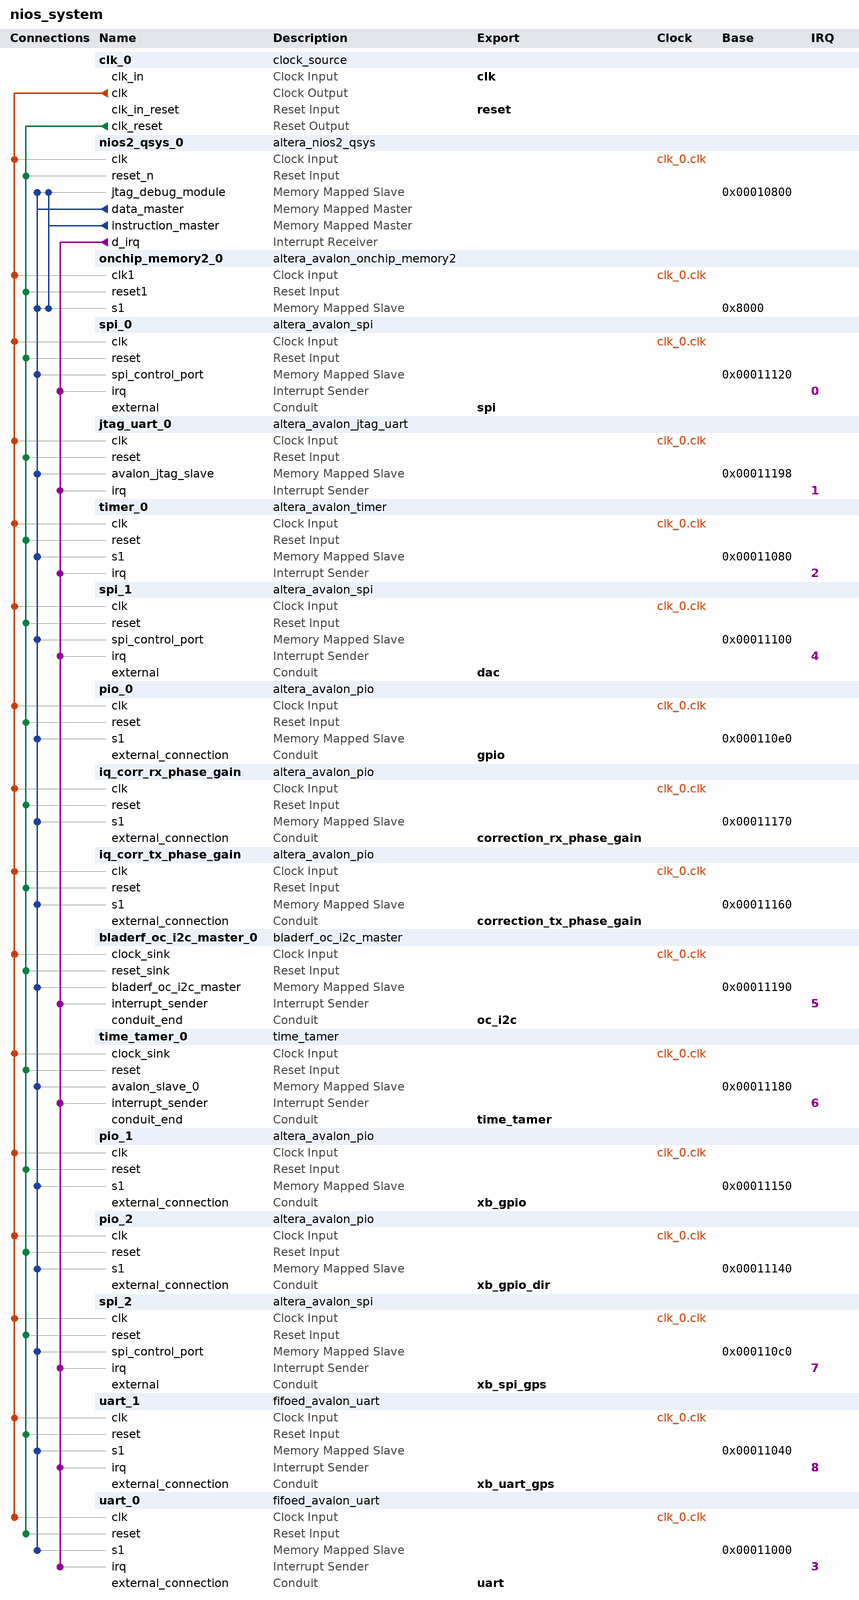
[diagram p0: system contents]
# Platform Designer (Qsys) system nios_system, Cyclone IV E EP4CE40F23C8
# Parameters at their usual value, and those the tool derives, are not listed.
package require -exact qsys 13.1
create_system nios_system
set_project_property DEVICE_FAMILY {Cyclone IV E}
set_project_property DEVICE EP4CE40F23C8

add_instance clk_0 clock_source 13.1
set_instance_parameter_value clk_0 clockFrequency 80000000
set_instance_parameter_value clk_0 resetSynchronousEdges DEASSERT

add_instance nios2_qsys_0 altera_nios2_qsys 13.1
set_instance_parameter_value nios2_qsys_0 resetSlave onchip_memory2_0.s1
set_instance_parameter_value nios2_qsys_0 exceptionSlave onchip_memory2_0.s1
set_instance_parameter_value nios2_qsys_0 breakSlave nios2_qsys_0.jtag_debug_module
set_instance_parameter_value nios2_qsys_0 impl Tiny
set_instance_parameter_value nios2_qsys_0 icache_size 2048

add_instance onchip_memory2_0 altera_avalon_onchip_memory2 13.1
set_instance_parameter_value onchip_memory2_0 dataWidth 32
set_instance_parameter_value onchip_memory2_0 dualPort false
set_instance_parameter_value onchip_memory2_0 initMemContent true
set_instance_parameter_value onchip_memory2_0 initializationFileName onchip_mem.hex
set_instance_parameter_value onchip_memory2_0 memorySize 32768

add_instance spi_0 altera_avalon_spi 13.1
set_instance_parameter_value spi_0 clockPolarity 0
set_instance_parameter_value spi_0 dataWidth 8
set_instance_parameter_value spi_0 masterSPI true
set_instance_parameter_value spi_0 numberOfSlaves 1
set_instance_parameter_value spi_0 targetClockRate 40000000
set_instance_parameter_value spi_0 targetSlaveSelectToSClkDelay 2.0

add_instance jtag_uart_0 altera_avalon_jtag_uart 13.1
set_instance_parameter_value jtag_uart_0 simInteractiveOptions INTERACTIVE_INPUT_OUTPUT

add_instance timer_0 altera_avalon_timer 13.1
set_instance_parameter_value timer_0 counterSize 64
set_instance_parameter_value timer_0 period 1
set_instance_parameter_value timer_0 periodUnits MSEC

add_instance spi_1 altera_avalon_spi 13.1
set_instance_parameter_value spi_1 clockPhase 1
set_instance_parameter_value spi_1 clockPolarity 1
set_instance_parameter_value spi_1 dataWidth 8
set_instance_parameter_value spi_1 masterSPI true
set_instance_parameter_value spi_1 numberOfSlaves 2
set_instance_parameter_value spi_1 targetClockRate 9600000

add_instance pio_0 altera_avalon_pio 13.1
set_instance_parameter_value pio_0 bitModifyingOutReg true
set_instance_parameter_value pio_0 direction Output
set_instance_parameter_value pio_0 width 32

add_instance iq_corr_rx_phase_gain altera_avalon_pio 13.1
set_instance_parameter_value iq_corr_rx_phase_gain direction Output
set_instance_parameter_value iq_corr_rx_phase_gain width 32

add_instance iq_corr_tx_phase_gain altera_avalon_pio 13.1
set_instance_parameter_value iq_corr_tx_phase_gain direction Output
set_instance_parameter_value iq_corr_tx_phase_gain resetValue 1
set_instance_parameter_value iq_corr_tx_phase_gain width 32

add_instance bladerf_oc_i2c_master_0 bladerf_oc_i2c_master 1.0
set_instance_parameter_value bladerf_oc_i2c_master_0 ARST_LVL 1

add_instance time_tamer_0 time_tamer 1.0
set_instance_parameter_value time_tamer_0 RESET_LEVEL 1

add_instance pio_1 altera_avalon_pio 13.1
set_instance_parameter_value pio_1 direction InOut
set_instance_parameter_value pio_1 width 32

add_instance pio_2 altera_avalon_pio 13.1
set_instance_parameter_value pio_2 direction Output
set_instance_parameter_value pio_2 width 32

add_instance spi_2 altera_avalon_spi 13.1
set_instance_parameter_value spi_2 clockPhase 1
set_instance_parameter_value spi_2 clockPolarity 0
set_instance_parameter_value spi_2 dataWidth 8
set_instance_parameter_value spi_2 masterSPI true
set_instance_parameter_value spi_2 numberOfSlaves 1
set_instance_parameter_value spi_2 targetClockRate 6700000

add_instance uart_1 fifoed_avalon_uart 13.1
set_instance_parameter_value uart_1 baud 4800
set_instance_parameter_value uart_1 dataBits 8
set_instance_parameter_value uart_1 fixedBaud false
set_instance_parameter_value uart_1 parity NONE
set_instance_parameter_value uart_1 simInteractiveInputEnable false
set_instance_parameter_value uart_1 simInteractiveOutputEnable false
set_instance_parameter_value uart_1 simTrueBaud false
set_instance_parameter_value uart_1 stopBits 1
set_instance_parameter_value uart_1 syncRegDepth 2
set_instance_parameter_value uart_1 useCtsRts false
set_instance_parameter_value uart_1 useEopRegister false
set_instance_parameter_value uart_1 useRelativePathForSimFile false
set_instance_parameter_value uart_1 use_status_bit_clear false
set_instance_parameter_value uart_1 use_tx_fifo true
set_instance_parameter_value uart_1 fifo_size_tx 256
set_instance_parameter_value uart_1 tx_fifo_LE false
set_instance_parameter_value uart_1 tx_IRQ_Threshold 1
set_instance_parameter_value uart_1 use_rx_fifo true
set_instance_parameter_value uart_1 fifo_size_rx 8192
set_instance_parameter_value uart_1 rx_fifo_LE false
set_instance_parameter_value uart_1 rx_IRQ_Threshold 1
set_instance_parameter_value uart_1 fifo_export_used false
set_instance_parameter_value uart_1 hw_cts false
set_instance_parameter_value uart_1 trans_pin false
set_instance_parameter_value uart_1 use_timout true
set_instance_parameter_value uart_1 timeout_value 4
set_instance_parameter_value uart_1 use_gap_detection false
set_instance_parameter_value uart_1 gap_value 4
set_instance_parameter_value uart_1 use_timestamp false
set_instance_parameter_value uart_1 use_ext_timestamp false
set_instance_parameter_value uart_1 timestamp_width 8
set_instance_parameter_value uart_1 export_handshake false
set_instance_parameter_value uart_1 add_error_bits false
set_instance_parameter_value uart_1 driver_pass_error_bits false

add_instance uart_0 fifoed_avalon_uart 13.1
set_instance_parameter_value uart_0 baud 115200
set_instance_parameter_value uart_0 dataBits 8
set_instance_parameter_value uart_0 fixedBaud false
set_instance_parameter_value uart_0 parity NONE
set_instance_parameter_value uart_0 simInteractiveInputEnable false
set_instance_parameter_value uart_0 simInteractiveOutputEnable false
set_instance_parameter_value uart_0 simTrueBaud false
set_instance_parameter_value uart_0 stopBits 1
set_instance_parameter_value uart_0 syncRegDepth 2
set_instance_parameter_value uart_0 useCtsRts false
set_instance_parameter_value uart_0 useEopRegister false
set_instance_parameter_value uart_0 useRelativePathForSimFile false
set_instance_parameter_value uart_0 use_status_bit_clear false
set_instance_parameter_value uart_0 use_tx_fifo true
set_instance_parameter_value uart_0 fifo_size_tx 16
set_instance_parameter_value uart_0 tx_fifo_LE false
set_instance_parameter_value uart_0 tx_IRQ_Threshold 1
set_instance_parameter_value uart_0 use_rx_fifo true
set_instance_parameter_value uart_0 fifo_size_rx 64
set_instance_parameter_value uart_0 rx_fifo_LE false
set_instance_parameter_value uart_0 rx_IRQ_Threshold 1
set_instance_parameter_value uart_0 fifo_export_used false
set_instance_parameter_value uart_0 hw_cts false
set_instance_parameter_value uart_0 trans_pin false
set_instance_parameter_value uart_0 use_timout true
set_instance_parameter_value uart_0 timeout_value 4
set_instance_parameter_value uart_0 use_gap_detection false
set_instance_parameter_value uart_0 gap_value 4
set_instance_parameter_value uart_0 use_timestamp false
set_instance_parameter_value uart_0 use_ext_timestamp false
set_instance_parameter_value uart_0 timestamp_width 8
set_instance_parameter_value uart_0 export_handshake false
set_instance_parameter_value uart_0 add_error_bits false
set_instance_parameter_value uart_0 driver_pass_error_bits false

# connections
add_connection clk_0.clk bladerf_oc_i2c_master_0.clock_sink clock
add_connection clk_0.clk iq_corr_rx_phase_gain.clk clock
add_connection clk_0.clk iq_corr_tx_phase_gain.clk clock
add_connection clk_0.clk jtag_uart_0.clk clock
add_connection clk_0.clk nios2_qsys_0.clk clock
add_connection clk_0.clk onchip_memory2_0.clk1 clock
add_connection clk_0.clk pio_0.clk clock
add_connection clk_0.clk pio_1.clk clock
add_connection clk_0.clk pio_2.clk clock
add_connection clk_0.clk spi_0.clk clock
add_connection clk_0.clk spi_1.clk clock
add_connection clk_0.clk spi_2.clk clock
add_connection clk_0.clk time_tamer_0.clock_sink clock
add_connection clk_0.clk timer_0.clk clock
add_connection clk_0.clk uart_0.clk clock
add_connection clk_0.clk uart_1.clk clock
add_connection clk_0.clk_reset bladerf_oc_i2c_master_0.reset_sink reset
add_connection clk_0.clk_reset iq_corr_rx_phase_gain.reset reset
add_connection clk_0.clk_reset iq_corr_tx_phase_gain.reset reset
add_connection clk_0.clk_reset jtag_uart_0.reset reset
add_connection clk_0.clk_reset nios2_qsys_0.reset_n reset
add_connection clk_0.clk_reset onchip_memory2_0.reset1 reset
add_connection clk_0.clk_reset pio_0.reset reset
add_connection clk_0.clk_reset pio_1.reset reset
add_connection clk_0.clk_reset pio_2.reset reset
add_connection clk_0.clk_reset spi_0.reset reset
add_connection clk_0.clk_reset spi_1.reset reset
add_connection clk_0.clk_reset spi_2.reset reset
add_connection clk_0.clk_reset time_tamer_0.reset reset
add_connection clk_0.clk_reset timer_0.reset reset
add_connection clk_0.clk_reset uart_0.reset reset
add_connection clk_0.clk_reset uart_1.reset reset
add_connection nios2_qsys_0.data_master bladerf_oc_i2c_master_0.bladerf_oc_i2c_master avalon
set_connection_parameter_value nios2_qsys_0.data_master/bladerf_oc_i2c_master_0.bladerf_oc_i2c_master baseAddress 0x00011190
add_connection nios2_qsys_0.data_master iq_corr_rx_phase_gain.s1 avalon
set_connection_parameter_value nios2_qsys_0.data_master/iq_corr_rx_phase_gain.s1 baseAddress 0x00011170
add_connection nios2_qsys_0.data_master iq_corr_tx_phase_gain.s1 avalon
set_connection_parameter_value nios2_qsys_0.data_master/iq_corr_tx_phase_gain.s1 baseAddress 0x00011160
add_connection nios2_qsys_0.data_master jtag_uart_0.avalon_jtag_slave avalon
set_connection_parameter_value nios2_qsys_0.data_master/jtag_uart_0.avalon_jtag_slave baseAddress 0x00011198
add_connection nios2_qsys_0.data_master nios2_qsys_0.jtag_debug_module avalon
set_connection_parameter_value nios2_qsys_0.data_master/nios2_qsys_0.jtag_debug_module baseAddress 0x00010800
add_connection nios2_qsys_0.data_master onchip_memory2_0.s1 avalon
set_connection_parameter_value nios2_qsys_0.data_master/onchip_memory2_0.s1 baseAddress 0x8000
add_connection nios2_qsys_0.data_master pio_0.s1 avalon
set_connection_parameter_value nios2_qsys_0.data_master/pio_0.s1 baseAddress 0x000110e0
add_connection nios2_qsys_0.data_master pio_1.s1 avalon
set_connection_parameter_value nios2_qsys_0.data_master/pio_1.s1 baseAddress 0x00011150
add_connection nios2_qsys_0.data_master pio_2.s1 avalon
set_connection_parameter_value nios2_qsys_0.data_master/pio_2.s1 baseAddress 0x00011140
add_connection nios2_qsys_0.data_master spi_0.spi_control_port avalon
set_connection_parameter_value nios2_qsys_0.data_master/spi_0.spi_control_port baseAddress 0x00011120
add_connection nios2_qsys_0.data_master spi_1.spi_control_port avalon
set_connection_parameter_value nios2_qsys_0.data_master/spi_1.spi_control_port baseAddress 0x00011100
add_connection nios2_qsys_0.data_master spi_2.spi_control_port avalon
set_connection_parameter_value nios2_qsys_0.data_master/spi_2.spi_control_port baseAddress 0x000110c0
add_connection nios2_qsys_0.data_master time_tamer_0.avalon_slave_0 avalon
set_connection_parameter_value nios2_qsys_0.data_master/time_tamer_0.avalon_slave_0 baseAddress 0x00011180
add_connection nios2_qsys_0.data_master timer_0.s1 avalon
set_connection_parameter_value nios2_qsys_0.data_master/timer_0.s1 baseAddress 0x00011080
add_connection nios2_qsys_0.data_master uart_0.s1 avalon
set_connection_parameter_value nios2_qsys_0.data_master/uart_0.s1 baseAddress 0x00011000
add_connection nios2_qsys_0.data_master uart_1.s1 avalon
set_connection_parameter_value nios2_qsys_0.data_master/uart_1.s1 baseAddress 0x00011040
add_connection nios2_qsys_0.instruction_master nios2_qsys_0.jtag_debug_module avalon
set_connection_parameter_value nios2_qsys_0.instruction_master/nios2_qsys_0.jtag_debug_module baseAddress 0x00010800
add_connection nios2_qsys_0.instruction_master onchip_memory2_0.s1 avalon
set_connection_parameter_value nios2_qsys_0.instruction_master/onchip_memory2_0.s1 baseAddress 0x8000
add_connection nios2_qsys_0.d_irq bladerf_oc_i2c_master_0.interrupt_sender interrupt
set_connection_parameter_value nios2_qsys_0.d_irq/bladerf_oc_i2c_master_0.interrupt_sender irqNumber 5
add_connection nios2_qsys_0.d_irq jtag_uart_0.irq interrupt
set_connection_parameter_value nios2_qsys_0.d_irq/jtag_uart_0.irq irqNumber 1
add_connection nios2_qsys_0.d_irq spi_0.irq interrupt
set_connection_parameter_value nios2_qsys_0.d_irq/spi_0.irq irqNumber 0
add_connection nios2_qsys_0.d_irq spi_1.irq interrupt
set_connection_parameter_value nios2_qsys_0.d_irq/spi_1.irq irqNumber 4
add_connection nios2_qsys_0.d_irq spi_2.irq interrupt
set_connection_parameter_value nios2_qsys_0.d_irq/spi_2.irq irqNumber 7
add_connection nios2_qsys_0.d_irq time_tamer_0.interrupt_sender interrupt
set_connection_parameter_value nios2_qsys_0.d_irq/time_tamer_0.interrupt_sender irqNumber 6
add_connection nios2_qsys_0.d_irq timer_0.irq interrupt
set_connection_parameter_value nios2_qsys_0.d_irq/timer_0.irq irqNumber 2
add_connection nios2_qsys_0.d_irq uart_0.irq interrupt
set_connection_parameter_value nios2_qsys_0.d_irq/uart_0.irq irqNumber 3
add_connection nios2_qsys_0.d_irq uart_1.irq interrupt
set_connection_parameter_value nios2_qsys_0.d_irq/uart_1.irq irqNumber 8

# exported interfaces
add_interface clk clock sink
set_interface_property clk EXPORT_OF clk_0.clk_in
add_interface reset reset sink
set_interface_property reset EXPORT_OF clk_0.clk_in_reset
add_interface spi conduit end
set_interface_property spi EXPORT_OF spi_0.external
add_interface dac conduit end
set_interface_property dac EXPORT_OF spi_1.external
add_interface gpio conduit end
set_interface_property gpio EXPORT_OF pio_0.external_connection
add_interface correction_rx_phase_gain conduit end
set_interface_property correction_rx_phase_gain EXPORT_OF iq_corr_rx_phase_gain.external_connection
add_interface correction_tx_phase_gain conduit end
set_interface_property correction_tx_phase_gain EXPORT_OF iq_corr_tx_phase_gain.external_connection
add_interface oc_i2c conduit end
set_interface_property oc_i2c EXPORT_OF bladerf_oc_i2c_master_0.conduit_end
add_interface time_tamer conduit end
set_interface_property time_tamer EXPORT_OF time_tamer_0.conduit_end
add_interface xb_gpio conduit end
set_interface_property xb_gpio EXPORT_OF pio_1.external_connection
add_interface xb_gpio_dir conduit end
set_interface_property xb_gpio_dir EXPORT_OF pio_2.external_connection
add_interface xb_spi_gps conduit end
set_interface_property xb_spi_gps EXPORT_OF spi_2.external
add_interface xb_uart_gps conduit end
set_interface_property xb_uart_gps EXPORT_OF uart_1.external_connection
add_interface uart conduit end
set_interface_property uart EXPORT_OF uart_0.external_connection

set_interconnect_requirement {$system} qsys_mm.clockCrossingAdapter HANDSHAKE
set_interconnect_requirement {$system} qsys_mm.maxAdditionalLatency 1

save_system nios_system.qsys
